# EAGLE design PICTQFP100_v2 (EAGLE 5.07)
PROJECT: Microchip TQFP-100 BB V1
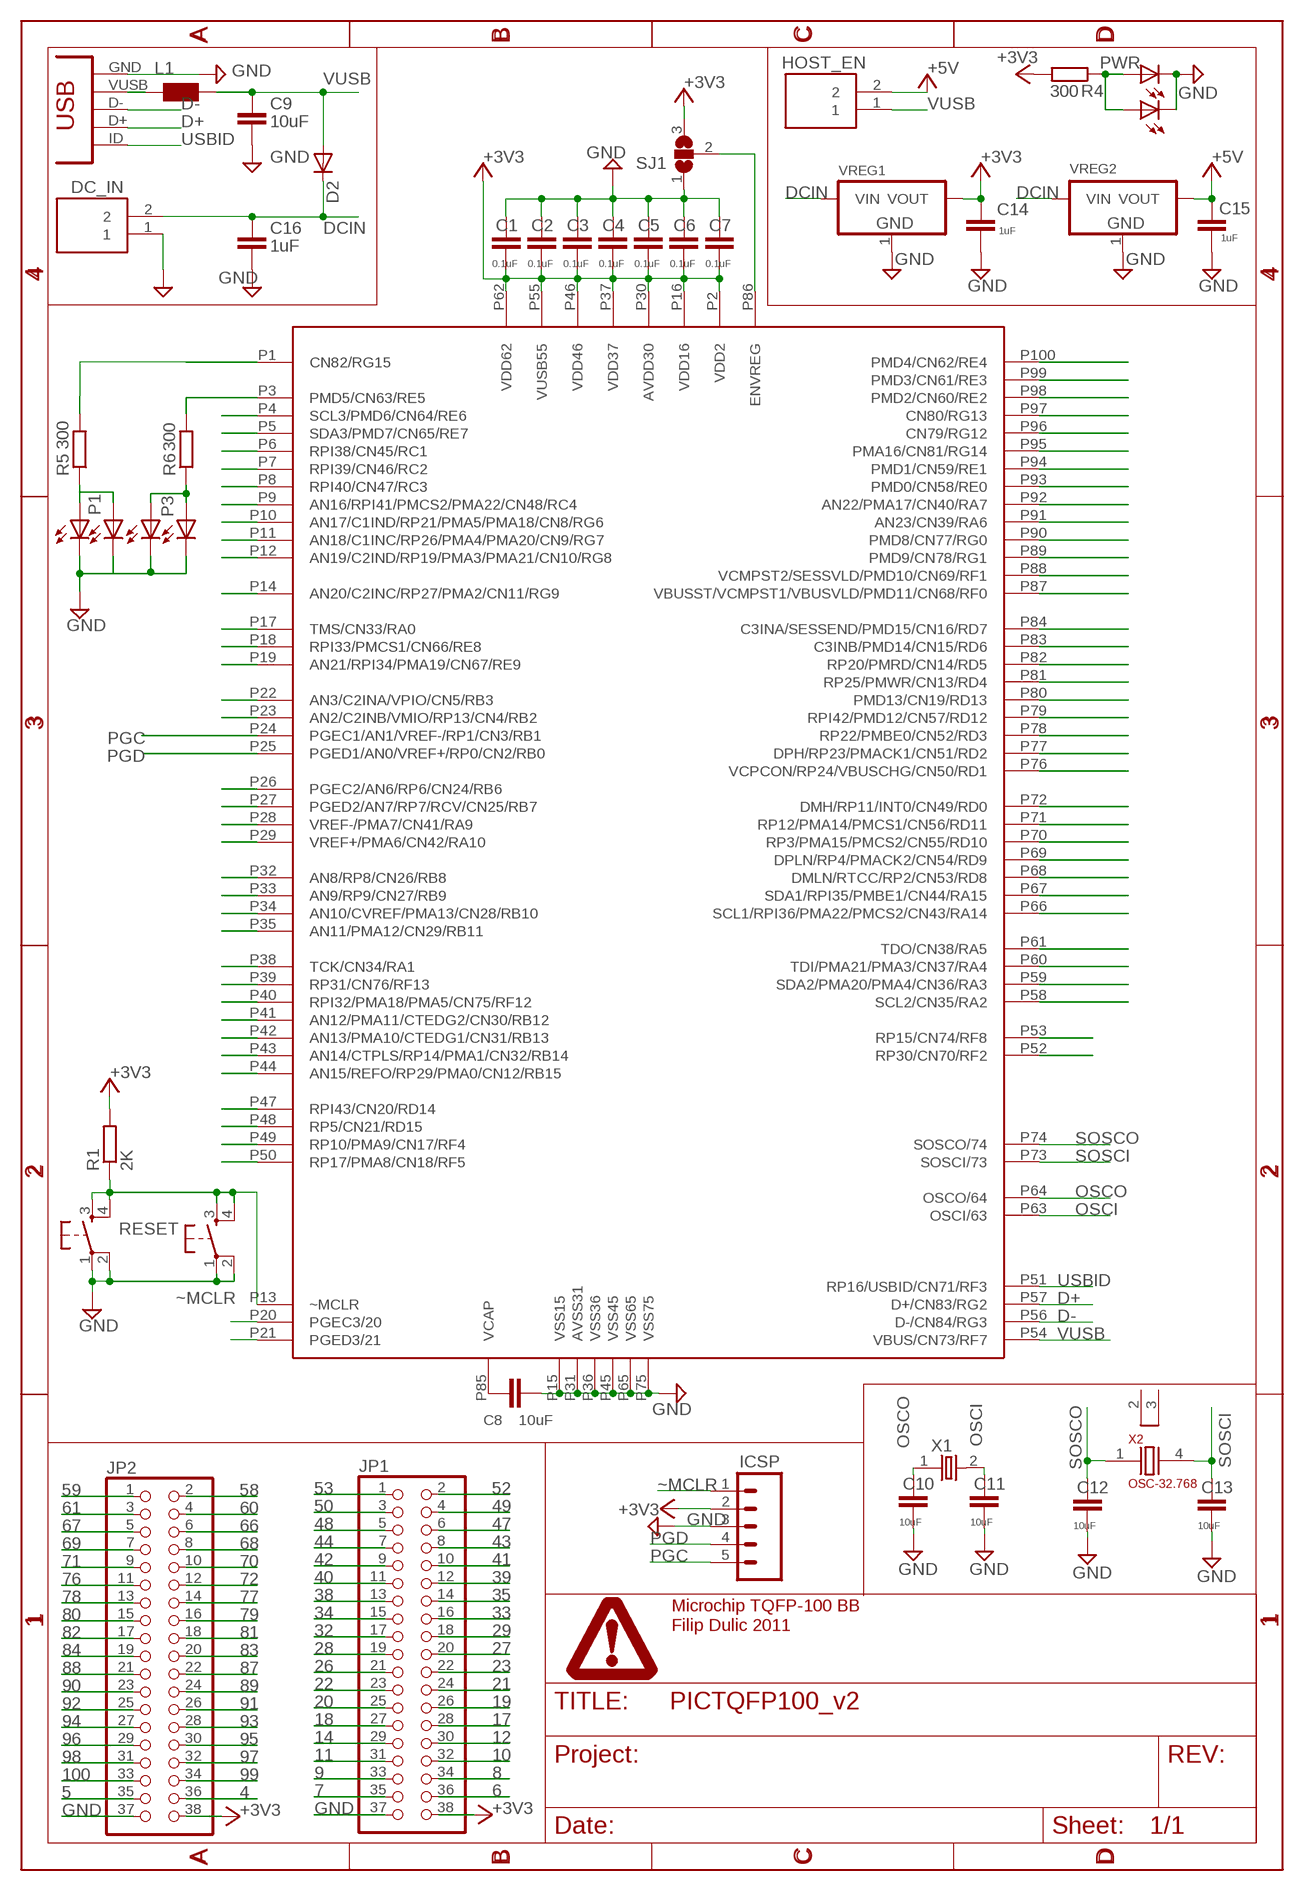
[diagram p0: schematic, sheet 1]

## Parts
C1  0.1uF  CAPC805  [C805]
C2  0.1uF  CAPC805  [C805]
C3  0.1uF  CAPC805  [C805]
C4  0.1uF  CAPC805  [C805]
C5  0.1uF  CAPC805  [C805]
C6  0.1uF  CAPC805  [C805]
C7  0.1uF  CAPC805  [C805]
C8  10uF  CAPC805  [C805]
C9  10uF  CAPC805  [C805]
C10  10uF  CAPC805  [C805]
C11  10uF  CAPC805  [C805]
C12  10uF  CAPC805  [C805]
C13  10uF  CAPC805  [C805]
C14  1uF  CAPC805  [C805]
C15  1uF  CAPC805  [C805]
C16  1uF  CAPC805  [C805]
D2  DIODE-SOD-123  [SOD-123]
DC_IN  HEADER1X2PTH  [M1X2]
HOST_EN  HEADER1X2PTH  [M1X2]
IC1  PIC24FJ256GB210  [DP_DEVICES_TQFP100-12MMX12MM]
ICSP  M05PTH  [1X05]
JP1  PINHD-2X19  [2X19]
JP2  PINHD-2X19  [2X19]
L1  WE-KIL_0805  [WE-KI_0805_B]
P1  P4  LEDCHIP-LED0805  [CHIP-LED0805]
P2  P4  LEDCHIP-LED0805  [CHIP-LED0805]
P3  P4  LEDCHIP-LED0805  [CHIP-LED0805]
P4  P4  LEDCHIP-LED0805  [CHIP-LED0805]
PWR  P4  LEDCHIP-LED0805  [CHIP-LED0805]
PWR1  P4  LEDCHIP-LED0805  [CHIP-LED0805]
R1  2K  RESISTORR805R805  [R805]
R4  300  RESISTORR805R805  [R805]
R5  300  RESISTORR805R805  [R805]
R6  300  RESISTORR805R805  [R805]
RESET  SW-SMD-SMALL  [TACT_SWITCH_SMALL]
RESET1  SW-SMD-SMALL  [TACT_SWITCH_SMALL]
SJ1  SJ2W  [SJ_2]
U$1  DINA4_L  [DP_LOGO]
USB  CON-USB-MINI-BUSB1  [CONN_USB_MINI-B]
VREG1  LD1117-3.3SOT223  [SOT223]
VREG2  LD1117-3.3SOT223  [SOT223]
X1  OSC-XTAL  [HC-49U]
X2  OSC-32.768  [CM309S]

## Nets
1: IC1.P1(CN82/RG15) R5.2
3: IC1.P3(PMD5/CN63/RE5) R6.2
4: IC1.P4(SCL3/PMD6/CN64/RE6) JP2.36
5: IC1.P5(SDA3/PMD7/CN65/RE7) JP2.35
6: IC1.P6(RPI38/CN45/RC1) JP1.36
7: IC1.P7(RPI39/CN46/RC2) JP1.35
8: IC1.P8(RPI40/CN47/RC3) JP1.34
9: IC1.P9(AN16/RPI41/PMCS2/PMA22/CN48/RC4) JP1.33
10: IC1.P10(AN17/C1IND/RP21/PMA5/PMA18/CN8/RG6) JP1.32
11: IC1.P11(AN18/C1INC/RP26/PMA4/PMA20/CN9/RG7) JP1.31
12: IC1.P12(AN19/C2IND/RP19/PMA3/PMA21/CN10/RG8) JP1.30
14: IC1.P14(AN20/C2INC/RP27/PMA2/CN11/RG9) JP1.29
17: IC1.P17(TMS/CN33/RA0) JP1.28
18: IC1.P18(RPI33/PMCS1/CN66/RE8) JP1.27
19: IC1.P19(AN21/RPI34/PMA19/CN67/RE9) JP1.26
20: IC1.P20(PGEC3/20) JP1.25
21: IC1.P21(PGED3/21) JP1.24
22: IC1.P22(AN3/C2INA/VPIO/CN5/RB3) JP1.23
23: IC1.P23(AN2/C2INB/VMIO/RP13/CN4/RB2) JP1.22
26: IC1.P26(PGEC2/AN6/RP6/CN24/RB6) JP1.21
27: IC1.P27(PGED2/AN7/RP7/RCV/CN25/RB7) JP1.20
28: IC1.P28(VREF-/PMA7/CN41/RA9) JP1.19
29: IC1.P29(VREF+/PMA6/CN42/RA10) JP1.18
32: IC1.P32(AN8/RP8/CN26/RB8) JP1.17
33: IC1.P33(AN9/RP9/CN27/RB9) JP1.16
34: IC1.P34(AN10/CVREF/PMA13/CN28/RB10) JP1.15
35: IC1.P35(AN11/PMA12/CN29/RB11) JP1.14
38: IC1.P38(TCK/CN34/RA1) JP1.13
39: IC1.P39(RP31/CN76/RF13) JP1.12
40: IC1.P40(RPI32/PMA18/PMA5/CN75/RF12) JP1.11
41: IC1.P41(AN12/PMA11/CTEDG2/CN30/RB12) JP1.10
42: IC1.P42(AN13/PMA10/CTEDG1/CN31/RB13) JP1.9
43: IC1.P43(AN14/CTPLS/RP14/PMA1/CN32/RB14) JP1.8
44: IC1.P44(AN15/REFO/RP29/PMA0/CN12/RB15) JP1.7
47: IC1.P47(RPI43/CN20/RD14) JP1.6
48: IC1.P48(RP5/CN21/RD15) JP1.5
49: IC1.P49(RP10/PMA9/CN17/RF4) JP1.4
50: IC1.P50(RP17/PMA8/CN18/RF5) JP1.3
52: IC1.P52(RP30/CN70/RF2) JP1.2
53: IC1.P53(RP15/CN74/RF8) JP1.1
58: IC1.P58(SCL2/CN35/RA2) JP2.2
59: IC1.P59(SDA2/PMA20/PMA4/CN36/RA3) JP2.1
60: IC1.P60(TDI/PMA21/PMA3/CN37/RA4) JP2.4
61: IC1.P61(TDO/CN38/RA5) JP2.3
66: IC1.P66(SCL1/RPI36/PMA22/PMCS2/CN43/RA14) JP2.6
67: IC1.P67(SDA1/RPI35/PMBE1/CN44/RA15) JP2.5
68: IC1.P68(DMLN/RTCC/RP2/CN53/RD8) JP2.8
69: IC1.P69(DPLN/RP4/PMACK2/CN54/RD9) JP2.7
70: IC1.P70(RP3/PMA15/PMCS2/CN55/RD10) JP2.10
71: IC1.P71(RP12/PMA14/PMCS1/CN56/RD11) JP2.9
72: IC1.P72(DMH/RP11/INT0/CN49/RD0) JP2.12
76: IC1.P76(VCPCON/RP24/VBUSCHG/CN50/RD1) JP2.11
77: IC1.P77(DPH/RP23/PMACK1/CN51/RD2) JP2.14
78: IC1.P78(RP22/PMBE0/CN52/RD3) JP2.13
79: IC1.P79(RPI42/PMD12/CN57/RD12) JP2.16
80: IC1.P80(PMD13/CN19/RD13) JP2.15
81: IC1.P81(RP25/PMWR/CN13/RD4) JP2.18
82: IC1.P82(RP20/PMRD/CN14/RD5) JP2.17
83: IC1.P83(C3INB/PMD14/CN15/RD6) JP2.20
84: IC1.P84(C3INA/SESSEND/PMD15/CN16/RD7) JP2.19
87: IC1.P87(VBUSST/VCMPST1/VBUSVLD/PMD11/CN68/RF0) JP2.22
88: IC1.P88(VCMPST2/SESSVLD/PMD10/CN69/RF1) JP2.21
89: IC1.P89(PMD9/CN78/RG1) JP2.24
90: IC1.P90(PMD8/CN77/RG0) JP2.23
91: IC1.P91(AN23/CN39/RA6) JP2.26
92: IC1.P92(AN22/PMA17/CN40/RA7) JP2.25
93: IC1.P93(PMD0/CN58/RE0) JP2.28
94: IC1.P94(PMD1/CN59/RE1) JP2.27
95: IC1.P95(PMA16/CN81/RG14) JP2.30
96: IC1.P96(CN79/RG12) JP2.29
97: IC1.P97(CN80/RG13) JP2.32
98: IC1.P98(PMD2/CN60/RE2) JP2.31
99: IC1.P99(PMD3/CN61/RE3) JP2.34
100: IC1.P100(PMD4/CN62/RE4) JP2.33
+3V3: C1.2 C2.2 C3.2 C4.2 C5.2 C6.2 C7.2 C14.1 IC1.P2(VDD2) IC1.P16(VDD16) IC1.P30(AVDD30) IC1.P37(VDD37) IC1.P46(VDD46) IC1.P55(VUSB55) IC1.P62(VDD62) ICSP.2 JP1.38 JP2.38 R1.2 R4.2 SJ1.3 VREG1.2(VOUT)
+5V: C15.1 HOST_EN.2 VREG2.2(VOUT)
D+: IC1.P57(D+/CN83/RG2) USB.D+
D-: IC1.P56(D-/CN84/RG3) USB.D-
DCIN: C16.1 D2.C DC_IN.2 VREG1.3(VIN) VREG2.3(VIN)
GND: C1.1 C2.1 C3.1 C4.1 C5.1 C6.1 C7.1 C8.2 C9.2 C10.2 C11.2 C12.2 C13.2 C14.2 C15.2 C16.2 DC_IN.1 IC1.P15(VSS15) IC1.P31(AVSS31) IC1.P36(VSS36) IC1.P45(VSS45) IC1.P65(VSS65) IC1.P75(VSS75) ICSP.3 JP1.37 JP2.37 P1.C P2.C P3.C P4.C PWR1.C PWR.C RESET1.1 RESET1.2 RESET.1 RESET.2 SJ1.1 USB.GND VREG1.1(GND) VREG2.1(GND)
N$1: C8.1 IC1.P85(VCAP)
N$3: IC1.P86(ENVREG) SJ1.2
N$6: PWR1.A PWR.A R4.1
N$7: P1.A P4.A R5.1
N$8: P2.A P3.A R6.1
OSCI: C11.1 IC1.P63(OSCI/63) X1.2
OSCO: C10.1 IC1.P64(OSCO/64) X1.1
PGC: IC1.P24(PGEC1/AN1/VREF-/RP1/CN3/RB1) ICSP.5
PGD: IC1.P25(PGED1/AN0/VREF+/RP0/CN2/RB0) ICSP.4
SOSCI: C13.1 IC1.P73(SOSCI/73) X2.4
SOSCO: C12.1 IC1.P74(SOSCO/74) X2.1
USBID: IC1.P51(RP16/USBID/CN71/RF3) USB.ID(USBID)
VUSB: C9.1 D2.A HOST_EN.1 IC1.P54(VBUS/CN73/RF7) L1.1
VUSBO: L1.2 USB.VUSB
~MCLR: IC1.P13(~MCLR) ICSP.1 R1.1 RESET1.3 RESET1.4 RESET.3 RESET.4
Unconnected: USB.BODY@1(BODY) USB.BODY@2(BODY) USB.BODY@3(BODY) USB.BODY@4(BODY) X2.2 X2.3

## Notes on the sheet
- Microchip TQFP-100 BB
- Filip Dulic 2011

## Library data of the parts
C1-C16 = dp_devices:CAP
D2 = dp_devices:DIODE: Various Diode Packages
DC_IN HOST_EN = dp_devices:HEADER1X2
IC1 = fica:PIC24FJ256GB210
ICSP = SparkFun:M05: Header 5 Standard 5-pin 0.1" header. Use with straight break away headers (SKU : PRT-00116), right angle break away headers (PRT-00553), swiss pins (PRT-00743), machine pins (PRT-00117), and female headers (PRT-00115). Molex polarized connector foot print use with SKU : PRT-08230 with associated crimp pins and housings.
JP1 JP2 = fica:PINHD-2X19: PIN HEADER
L1 = wuerth-elektronik:WE-KIL: SMD Wire Wound Ceramic Inductor WE-KIL - Low profile - High Q values -- Bluetooth -- Wireless LAN -- RF oscillation circuit -- IF impedance matching
P1-P4 PWR PWR1 = led:LED: LED OSRAM: - CHIPLED LG R971, LG N971, LY N971, LG Q971, LY Q971, LO R971, LY R971 LH N974, LH R974 LS Q976, LO Q976, LY Q976 LO Q996 - Hyper CHIPLED LW Q18S LB Q993, LB Q99A, LB R99A - SideLED LS A670, LO A670, LY A670, LG A670, LP A670 LB A673, LV A673, LT A673, LW A673 LH A674 LY A675 LS A676, LA A676, LO A676, LY A676, LW A676 LS A679, LY A679, LG A679 - Hyper Micro SIDELED® LS Y876, LA Y876, LO Y876, LY Y876 LT Y87S - SmartLED LW L88C, LW L88S LB L89C, LB L89S, LG L890 LS L89K, LO L89K, LY L89K LS L896, LA L896, LO L896, LY L896 - TOPLED LS T670, LO T670, LY T670, LG T670, LP T670 LSG T670, LSP T670, LSY T670, LOP T670, LYG T670 LG T671, LOG T671, LSG T671 LB T673, LV T673, LT T673, LW T673 LH T674 LS T676, LA T676, LO T676, LY T676, LB T676, LH T676, LSB T676, LW T676 LB T67C, LV T67C, LT T67C, LS T67K, LO T67K, LY T67K, LW E67C LS E67B, LA E67B, LO E67B, LY E67B, LB E67C, LV E67C, LT E67C LW T67C LS T679, LY T679, LG T679 LS T770, LO T770, LY T770, LG T770, LP T770 LB T773, LV T773, LT T773, LW T773 LH T774 LS E675, LA E675, LY E675, LS T675 LS T776, LA T776, LO T776, LY T776, LB T776 LHGB T686 LT T68C, LB T68C - Hyper Mini TOPLED® LB M676 - Mini TOPLED Santana® LG M470 LS M47K, LO M47K, LY M47K Source: http://www.osram.convergy.de LUXEON: - LUMILED® LXK2-PW12-R00, LXK2-PW12-S00, LXK2-PW14-U00, LXK2-PW14-V00 LXK2-PM12-R00, LXK2-PM12-S00, LXK2-PM14-U00 LXK2-PE12-Q00, LXK2-PE12-R00, LXK2-PE12-S00, LXK2-PE14-T00, LXK2-PE14-U00 LXK2-PB12-K00, LXK2-PB12-L00, LXK2-PB12-M00, LXK2-PB14-N00, LXK2-PB14-P00, LXK2-PB14-Q00 LXK2-PR12-L00, LXK2-PR12-M00, LXK2-PR14-Q00, LXK2-PR14-R00 LXK2-PD12-Q00, LXK2-PD12-R00, LXK2-PD12-S00 LXK2-PH12-R00, LXK2-PH12-S00 LXK2-PL12-P00, LXK2-PL12-Q00, LXK2-PL12-R00 Source: www.luxeon.com KINGBRIGHT: KA-3528ASYC Source: www.kingbright.com
R1 R4-R6 = dp_devices:RESISTOR
RESET RESET1 = dp_devices:SW-SMD-SMALL
SJ1 = jumper:SJ2W: SMD solder JUMPER
U$1 = dp_devices:DINA4_L: A4 DP frame Standard Dangerous Prototypes schematic frame. Automagically adds the DP logo and standard texts to the PCB Use the atrribute in the schematic editor to change the fields.; FF1: fulfillment by; FF2: Seeed Studio; FF3: www.seeedstudio.com; LICENSE: CC-BY-SA; PROJECT: Projectname; URL1: http://; URL2: DangerousPrototypes.com
USB = dp_devices:CON-USB-MINI-B: USB connector
VREG1 VREG2 = dp_devices:LD1117-3.3
X1 = dp_devices:OSC-XTAL
X2 = fica:OSC-32.768

## Board
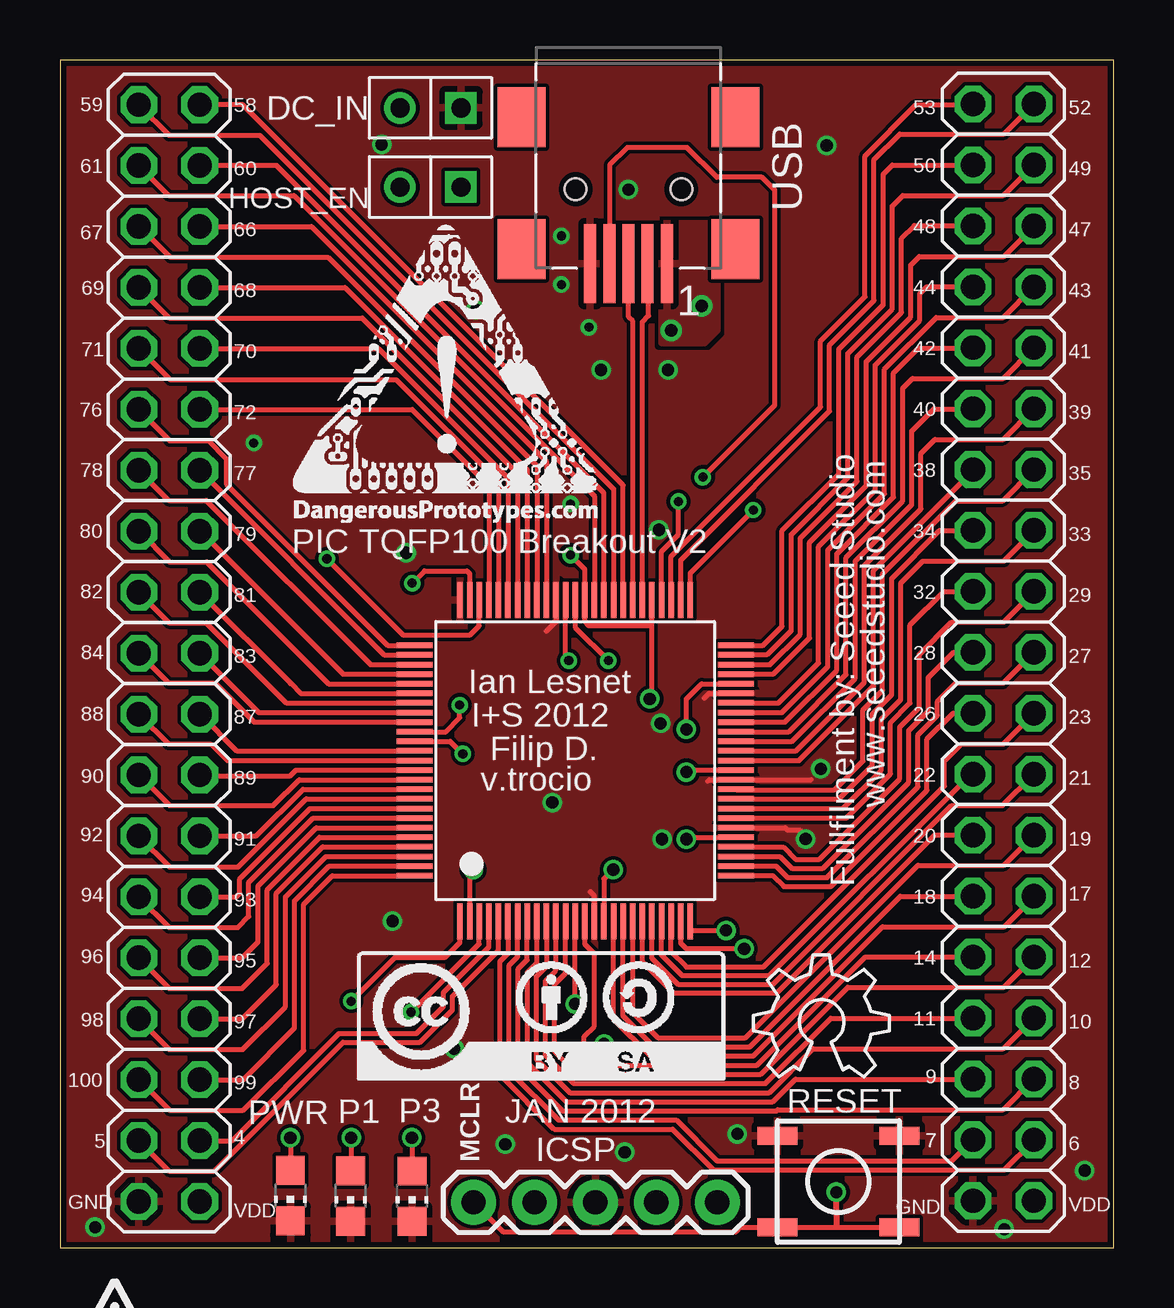
[diagram p1: board, top side]
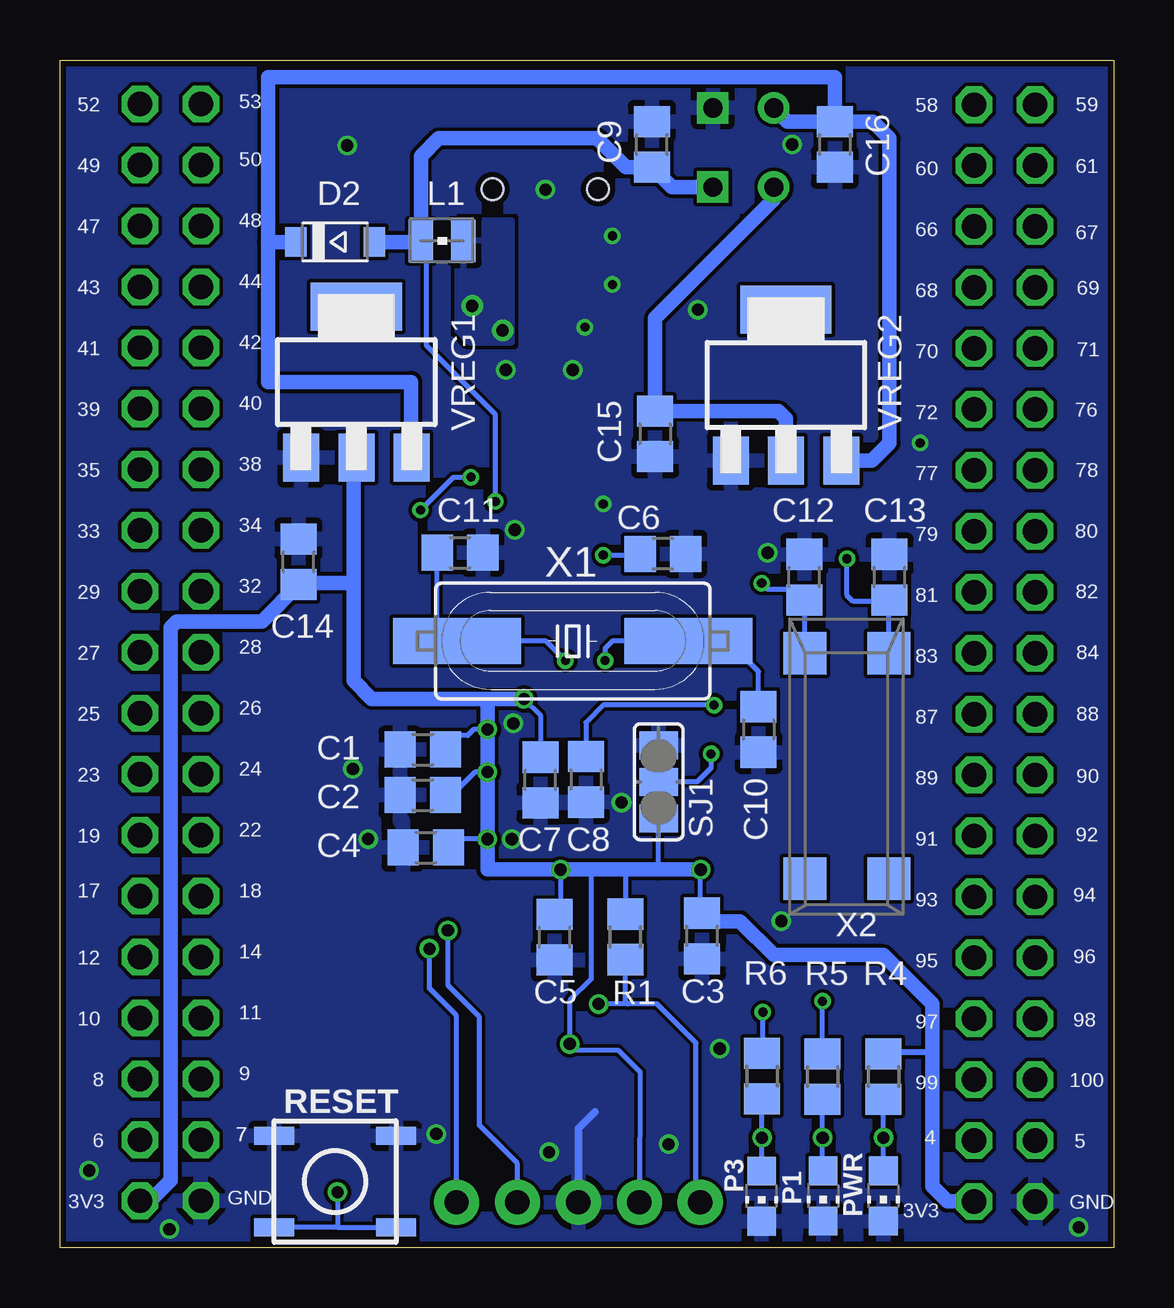
[diagram p2: board, bottom side, seen from below]

Size 43.93 x 49.52 mm. Coordinates in mm from the lower left corner, seen from the top.
Outline: 0,0 43.93,0 43.93,49.52 0,49.52 0,0
Copper layers (1*16): Top 0.035mm / dielectric 1.5mm / Bottom 0.035mm
Design rules "Fusion_eagle_rule_v1.1": minimum track width 6mil, minimum drill 12mil, track to track 6mil, track to pad 6mil, pad to pad 6mil, via to via 6mil, smd to smd 0mil, copper to edge 10mil, drill to drill 10mil, minimum pad ring 10mil, minimum via ring 6mil, stop-mask expansion 2mil, vias tented up to drill 100mil, thermal gap 10mil

### Footprints (pad centres in the part's own frame; a part is rotated, then mirrored left to right if it is on the bottom)
C805 = smd 1.3 x 1.5: 1 -0.95,0; 2 0.95,0
SOD-123 = smd 0.91 x 1.22: A 1.635,0; C -1.635,0
M1X2 = drill 0.8 square: 1 -1.27,0 | drill 0.8 round: 2 1.27,0
DP_DEVICES_TQFP100-12MMX12MM = smd 0.23 x 1.5: P1 -4.8,-6.7; P2 -4.4,-6.7; P3 -4,-6.7; P4 -3.6,-6.7; P5 -3.2,-6.7; P6 -2.8,-6.7; P7 -2.4,-6.7; P8 -2,-6.7; P9 -1.6,-6.7; P10 -1.2,-6.7; P11 -0.8,-6.7; P12 -0.4,-6.7; P13 0,-6.7; P14 0.4,-6.7; P15 0.8,-6.7; P16 1.2,-6.7; P17 1.6,-6.7; P18 2,-6.7; P19 2.4,-6.7; P20 2.8,-6.7; P21 3.2,-6.7; P22 3.6,-6.7; P23 4,-6.7; P24 4.4,-6.7; P25 4.8,-6.7; P51 4.8,6.7; P52 4.4,6.7; P53 4,6.7; P54 3.6,6.7; P55 3.2,6.7; P56 2.8,6.7; P57 2.4,6.7; P58 2,6.7; P59 1.6,6.7; P60 1.2,6.7; P61 0.8,6.7; P62 0.4,6.7; P63 0,6.7; P64 -0.4,6.7; P65 -0.8,6.7; P66 -1.2,6.7; P67 -1.6,6.7; P68 -2,6.7; P69 -2.4,6.7; P70 -2.8,6.7; P71 -3.2,6.7; P72 -3.6,6.7; P73 -4,6.7; P74 -4.4,6.7; P75 -4.8,6.7 | smd 1.5 x 0.23: P26 6.7,-4.8; P27 6.7,-4.4; P28 6.7,-4; P29 6.7,-3.6; P30 6.7,-3.2; P31 6.7,-2.8; P32 6.7,-2.4; P33 6.7,-2; P34 6.7,-1.6; P35 6.7,-1.2; P36 6.7,-0.8; P37 6.7,-0.4; P38 6.7,0; P39 6.7,0.4; P40 6.7,0.8; P41 6.7,1.2; P42 6.7,1.6; P43 6.7,2; P44 6.7,2.4; P45 6.7,2.8; P46 6.7,3.2; P47 6.7,3.6; P48 6.7,4; P49 6.7,4.4; P50 6.7,4.8; P76 -6.7,4.8; P77 -6.7,4.4; P78 -6.7,4; P79 -6.7,3.6; P80 -6.7,3.2; P81 -6.7,2.8; P82 -6.7,2.4; P83 -6.7,2; P84 -6.7,1.6; P85 -6.7,1.2; P86 -6.7,0.8; P87 -6.7,0.4; P88 -6.7,0; P89 -6.7,-0.4; P90 -6.7,-0.8; P91 -6.7,-1.2; P92 -6.7,-1.6; P93 -6.7,-2; P94 -6.7,-2.4; P95 -6.7,-2.8; P96 -6.7,-3.2; P97 -6.7,-3.6; P98 -6.7,-4; P99 -6.7,-4.4; P100 -6.7,-4.8
1X05 = drill 1.016 pad 1.88 round: 1 0,0; 2 2.54,0; 3 5.08,0; 4 7.62,0; 5 10.16,0
2X19 = drill 1.016 octagon: 1 -22.86,-1.27; 2 -22.86,1.27; 3 -20.32,-1.27; 4 -20.32,1.27; 5 -17.78,-1.27; 6 -17.78,1.27; 7 -15.24,-1.27; 8 -15.24,1.27; 9 -12.7,-1.27; 10 -12.7,1.27; 11 -10.16,-1.27; 12 -10.16,1.27; 13 -7.62,-1.27; 14 -7.62,1.27; 15 -5.08,-1.27; 16 -5.08,1.27; 17 -2.54,-1.27; 18 -2.54,1.27; 19 0,-1.27; 20 0,1.27; 21 2.54,-1.27; 22 2.54,1.27; 23 5.08,-1.27; 24 5.08,1.27; 25 7.62,-1.27; 26 7.62,1.27; 27 10.16,-1.27; 28 10.16,1.27; 29 12.7,-1.27; 30 12.7,1.27; 31 15.24,-1.27; 32 15.24,1.27; 33 17.78,-1.27; 34 17.78,1.27; 35 20.32,-1.27; 36 20.32,1.27; 37 22.86,-1.27; 38 22.86,1.27
WE-KI_0805_B = smd 1.02 x 1.78: 1 -0.89,0; 2 0.89,0
CHIP-LED0805 = smd 1.2 x 1.2: A 0,-1.05; C 0,1.05
R805 = smd 1.3 x 1.5: 1 -0.95,0; 2 0.95,0
TACT_SWITCH_SMALL = smd 1.651 x 0.762: 1 -2.54,1.905; 2 2.54,1.905; 3 -2.54,-1.905; 4 2.54,-1.905
SJ_2 = smd 1.168 x 1.6: 1 -1.524,0; 2 0,0; 3 1.524,0
CONN_USB_MINI-B = smd 2 x 2.5: BODY@1 -4.45,2.5; BODY@2 4.45,2.5; BODY@3 4.45,-3; BODY@4 -4.45,-3 | smd 0.5 x 3.3: D+ 0,3.1; D- -0.8,3.1; GND 1.6,3.1; ID 0.8,3.1; VUSB -1.6,3.1 | hole 0.9: -2.2,0; 2.2,0
SOT223 = smd 1.5 x 2: 1 -2.3,-3.15; 2 0,-3.15; 3 2.3,-3.15 | smd 3.8 x 2: 4 0,3.15
HC-49U = smd 5.334 x 1.93: 1 -4.826,0; 2 4.826,0
CM309S = smd 1.778 x 1.778: 1 -4.7,-1.75; 2 4.7,-1.75; 3 4.7,1.75; 4 -4.7,1.75

### Placement (x,y rotation side)
C1  28.8,20.78 0 bottom
C2  28.8,18.88 0 bottom
C3  17.16,13 90 bottom
C4  28.68,16.69 0 bottom
C5  23.31,12.95 90 bottom
C6  18.8,28.93 180 bottom
C7  23.9,19.51 90 bottom
C8  22,19.53 270 bottom
C9  19.25,46 90 bottom
C10  14.81,21.62 270 bottom
C11  27.25,28.98 0 bottom
C12  12.9,27.97 90 bottom
C13  9.35,27.97 90 bottom
C14  33.99,28.6 90 bottom
C15  19.13,33.93 270 bottom
C16  11.63,46 270 bottom
D2  32.46,41.94 0 bottom
DC_IN  15.44,47.52 180 top
HOST_EN  15.44,44.22 180 top
IC1  21.48,20.32 0 top
ICSP  17.24,1.91 0 top
JP1  39.33,24.83 270 top
JP2  4.55,24.8 270 top
L1  28,41.98 0 bottom
P1  12.12,2.17 180 top
P2  14.68,2.16 180 bottom
P3  14.67,2.16 180 top
P4  12.12,2.17 180 bottom
PWR  9.61,2.18 180 top
PWR1  9.6,2.17 180 bottom
R1  20.36,12.97 90 bottom
R4  9.6,7.14 90 bottom
R5  12.14,7.14 90 bottom
R6  14.67,7.16 90 bottom
RESET  32.45,2.77 0 top
RESET1  32.46,2.77 0 bottom
SJ1  18.97,19.43 270 bottom
U$1  2.29,-3.94 0 top  (outside the outline)
U$2  [DP_LOGO_ART_0.5X0.5]  9.73,30.25 0 top
U$3  [OSHW_6X200_NOTEXT]  28.91,7.14 0 top
U$4  [CC-BY-SA]  12.4,7.01 0 top
USB  23.7,44.13 180 top
VREG1  31.57,36.09 0 bottom
VREG2  13.67,35.97 0 bottom
X1  22.56,25.3 180 bottom
X2  11.13,20.09 270 bottom

### Tracks (layer width: path | path; a pad name or v marks a point on that pad's centre or on a via)
1  (via drill 0.38)
  Top 0.203: IC1.P1 16.68,12.74 16.05,12.12 13.97,12.12 v12.14,10.29
  Bottom 0.203: R5.2 v12.14,10.29
3  (via drill 0.38)
  Top 0.203: IC1.P3 17.48,12.68 v14.63,9.83
  Bottom 0.203: v14.63,9.83 14.63,8.15 R6.2
4
  Top 0.203: IC1.P4 17.88,12.54 15.99,10.66 15.99,10.07 14.86,8.94 11.63,8.94 7.17,4.48 JP2.36
5
  Top 0.203: IC1.P5 18.28,12.41 16.36,10.49 16.36,9.92 15.01,8.57 11.8,8.57 6.43,3.2 4.55,3.2 JP2.35
6
  Top 0.203: JP1.36 40.6,4.48 39.37,3.25 27.24,3.25 25.54,4.95 20.6,4.95 18.34,7.21 18.34,11.94 18.69,12.29 18.69,13.6 IC1.P6
7
  Top 0.203: IC1.P7 19.08,12.14 18.72,11.79 18.72,7.39 20.78,5.33 25.69,5.33 27.39,3.63 27.41,3.64 37.19,3.64 JP1.35
8
  Top 0.203: JP1.34 39.32,5.77 29.92,5.77 29.87,5.72 20.96,5.72 19.1,7.57 19.1,11.63 19.48,12.01 IC1.P8
9
  Top 0.203: IC1.P9 19.88,11.87 19.48,11.48 19.48,7.72 21.11,6.1 29.72,6.1 30.66,7.04 38.04,7.04 JP1.33
10
  Top 0.203: JP1.32 39.32,8.31 31.39,8.31 29.57,6.48 21.26,6.48 19.86,7.87 19.86,11.33 20.29,11.76 20.29,13.6 IC1.P10
11
  Top 0.203: IC1.P11 20.68,11.58 20.24,11.15 20.24,8.03 21.41,6.86 29.41,6.86 32.13,9.58 38.04,9.58 JP1.31
12
  Top 0.203: IC1.P12 21.08,11.45 20.63,11 20.63,8.18 21.56,7.24 29.21,7.24 32.84,10.87 39.34,10.87 JP1.30
14
  Top 0.203: JP1.29 33.57,12.13 29.06,7.62 22.2,7.62 21.84,7.98 21.84,8.81 22.28,9.25 22.28,12.27 21.9,12.65 21.9,13.6 IC1.P14
17
  Top 0.203: IC1.P17 23.08,9.54 24.61,8 28.91,8 34.29,13.39 39.37,13.39 40.6,14.61 JP1.28
18
  Top 0.203: IC1.P18 23.48,9.67 24.77,8.38 28.75,8.38 35.03,14.66 38.04,14.66 JP1.27
19
  Top 0.203: IC1.P19 23.88,9.8 24.92,8.76 28.58,8.76 35.76,15.95 39.34,15.95 JP1.26
20
  Top 0.203: IC1.P20 24.28,11.93 25.58,10.63 29.88,10.63 36.47,17.21 JP1.25
21
  Top 0.203: IC1.P21 24.68,12.08 25.75,11 29.72,11 37.16,18.44 39.29,18.44 JP1.24
22
  Top 0.203: IC1.P22 25.07,12.22 25.93,11.35 29.57,11.35 37.96,19.75 JP1.23
23
  Top 0.203: JP1.22 39.32,21.01 37.57,21.01 36.87,20.31 36.87,19.26 29.32,11.71 26.11,11.71 25.48,12.34 IC1.P23
26
  Top 0.203: IC1.P26 29.72,15.52 30.18,15.06 32.13,15.06 36.14,19.08 36.14,21.21 37.24,22.3 38.04,22.3 JP1.21
27
  Top 0.203: JP1.20 39.32,23.55 37.34,23.55 36.58,22.78 36.58,22.2 35.76,21.39 35.76,19.23 31.98,15.44 30.33,15.44 29.85,15.92 IC1.P27
28
  Top 0.203: IC1.P28 30.01,16.32 30.51,15.82 31.8,15.82 35.38,19.41 35.38,21.56 36.2,22.38 36.2,23.77 37.26,24.84 38.04,24.84 JP1.19
29
  Top 0.203: JP1.18 40.6,27.34 39.34,26.09 37.16,26.09 35.81,24.74 35.81,22.53 35,21.72 35,19.56 31.65,16.21 30.66,16.21 30.15,16.71 IC1.P29
32
  Top 0.203: IC1.P32 32.78,17.92 34.62,19.76 34.62,21.89 35.43,22.71 35.43,25.96 36.84,27.37 JP1.17
33
  Top 0.203: JP1.16 40.6,29.88 39.34,28.63 35.97,28.63 35.05,27.71 35.05,22.86 34.24,22.05 34.24,19.91 32.64,18.31 IC1.P33
34
  Top 0.203: JP1.15 36.67,29.91 34.67,27.91 34.67,23.06 33.86,22.25 33.86,20.12 32.46,18.72 IC1.P34
  Top 0.305: JP1.15 38.02,29.94
35
  Top 0.203: JP1.14 39.29,31.14 37.34,31.14 34.29,28.09 34.29,23.24 33.48,22.43 33.48,20.29 32.28,19.1 28.2,19.1 IC1.P35
38
  Top 0.203: IC1.P38 30.81,20.32 33.91,23.42 33.91,28.24 38.13,32.46 38.04,32.46 JP1.13
39
  Top 0.203: JP1.12 39.32,33.71 36.47,33.71 35.89,33.12 35.89,30.81 33.53,28.45 33.53,23.57 30.68,20.73 28.18,20.73 IC1.P39
40
  Top 0.203: IC1.P40 30.52,21.12 33.15,23.75 33.15,28.63 35.51,30.99 35.51,34.06 36.42,34.98 38.04,34.98 JP1.11
41
  Top 0.203: JP1.10 39.32,36.25 35.53,36.25 35.13,35.84 35.13,31.14 32.77,28.78 32.77,23.9 30.38,21.51 IC1.P41
42
  Top 0.203: IC1.P42 30.23,21.92 32.39,24.08 32.39,28.93 34.75,31.29 34.75,36.47 35.79,37.52 38.04,37.52 JP1.9
43
  Top 0.203: IC1.P43 30.09,22.32 32,24.23 32,29.08 34.37,31.45 34.37,36.63 36.53,38.79 39.32,38.79 JP1.8
44
  Top 0.203: JP1.7 36.13,40.07 35.84,39.78 35.84,38.66 33.99,36.8 33.99,31.6 31.62,29.24 31.62,24.38 29.95,22.71 IC1.P44
47
  Top 0.203: JP1.6 40.6,42.58 39.34,41.33 35.81,41.33 35.46,40.97 35.46,38.81 33.6,36.96 33.6,31.78 31.24,29.41 31.24,25.43 29.74,23.93 IC1.P47
48
  Top 0.203: IC1.P48 29.6,24.32 30.86,25.58 30.86,29.59 33.22,31.95 33.22,37.13 35.08,38.99 35.08,42.09 35.61,42.62 38.04,42.62 JP1.5
49
  Top 0.203: JP1.4 39.32,43.87 35.13,43.87 34.7,43.43 34.7,39.14 32.84,37.29 32.84,32.11 30.48,29.74 30.48,25.73 29.49,24.74 28.2,24.74 IC1.P49
50
  Top 0.203: IC1.P50 29.31,25.12 30.1,25.91 30.1,29.9 32.46,32.26 32.46,37.47 34.32,39.32 34.32,44.75 34.7,45.14 38.04,45.14 JP1.3
52
  Top 0.203: JP1.2 39.34,46.43 35,46.43 33.93,45.36 33.93,39.5 32.08,37.64 32.08,34.87 25.88,28.68 25.88,27.03 IC1.P52
53
  Top 0.203: IC1.P53 25.48,28.83 31.7,35.05 31.7,37.8 33.55,39.65 33.55,45.52 35.69,47.65 38.02,47.65 JP1.1
58
  Top 0.203: JP2.2 7.61,47.66 23.48,31.79 IC1.P58
59
  Top 0.203: JP2.1 3.28,47.64 4.55,46.38 8.33,46.38 23.08,31.64 IC1.P59
60
  Top 0.203: JP2.4 9.04,45.12 22.68,31.48 IC1.P60
61
  Top 0.203: JP2.3 4.52,43.87 9.75,43.87 22.28,31.34 IC1.P61
66
  Top 0.203: JP2.6 10.48,42.58 20.28,32.79 IC1.P66
67
  Top 0.203: IC1.P67 19.88,32.6 11.18,41.3 4.6,41.3 3.32,42.58 JP2.5
68
  Top 0.203: JP2.8 11.88,40.04 19.48,32.44 IC1.P68
69
  Top 0.203: JP2.7 4.55,38.76 12.6,38.76 19.08,32.28 IC1.P69
70
  Top 0.203: IC1.P70 18.68,32.1 13.28,37.5 JP2.10
71
  Top 0.203: JP2.9 3.3,37.5 4.6,36.2 14.02,36.2 18.28,31.94 IC1.P71
72
  Top 0.203: IC1.P72 17.88,31.76 14.68,34.95 JP2.12
76
  Top 0.203: JP2.11 3.28,34.94 4.57,33.66 6.17,33.66 6.93,32.89 6.93,31.85 13.67,25.12 IC1.P76
77
  Top 0.203: IC1.P77 13.52,24.72 JP2.14
78
  Top 0.203: JP2.13 3.28,32.4 4.52,31.17 6.1,31.17 12.94,24.32 IC1.P78
79
  Top 0.203: JP2.16 5.84,29.88 11.79,23.92 IC1.P79
80
  Top 0.203: JP2.15 3.3,29.88 4.57,28.6 6.12,28.6 11.2,23.52 IC1.P80
81
  Top 0.203: JP2.18 5.82,27.32 9.63,23.52 | 9.63,23.52 9.6,23.52 | IC1.P81 10.03,23.12 9.63,23.52
82
  Top 0.203: JP2.17 3.28,27.32 4.55,26.06 6.1,26.06 9.44,22.72 IC1.P82
83
  Top 0.203: JP2.20 8.29,22.32 IC1.P83
84
  Top 0.203: IC1.P84 8.1,21.92 6.48,23.55 4.53,23.55 JP2.19
87
  Top 0.203: JP2.22 5.84,22.26 7.37,20.72 IC1.P87
88
  Top 0.203: JP2.21 4.52,21.01 6.3,21.01 6.99,20.32 IC1.P88
89
  Top 0.203: IC1.P89 9.84,19.92 9.6,19.69 5.86,19.69 JP2.24
90
  Top 0.203: JP2.23 3.3,19.72 4.57,18.44 8.89,18.44 9.97,19.52 IC1.P90
91
  Top 0.203: IC1.P91 10.13,19.12 8.19,17.18 JP2.26
92
  Top 0.203: JP2.25 3.28,17.16 4.57,15.88 7.42,15.88 10.26,18.72 IC1.P92
93
  Top 0.203: JP2.28 7.35,14.64 7.49,14.78 7.49,15.39 10.42,18.32 IC1.P93
94
  Top 0.203: JP2.27 4.55,13.36 7.42,13.36 7.87,13.82 7.87,15.24 10.55,17.92 IC1.P94
95
  Top 0.203: IC1.P95 10.69,17.52 8.26,15.09 8.26,12.75 7.59,12.09 JP2.30
96
  Top 0.203: IC1.P96 10.82,17.12 8.64,14.94 8.64,11.86 7.59,10.82 4.55,10.82 3.28,12.08 JP2.29
97
  Top 0.203: IC1.P97 10.95,16.72 9.02,14.78 9.02,10.97 7.6,9.56 JP2.32
98
  Top 0.203: IC1.P98 11.09,16.32 9.4,14.63 9.4,10.06 7.62,8.28 4.55,8.28 JP2.31
99
  Top 0.203: IC1.P99 11.22,15.92 9.78,14.48 9.78,9.17 7.63,7.02 JP2.34
100
  Top 0.203: JP2.33 3.3,7.02 4.57,5.74 7.65,5.74 10.16,8.23 10.16,14.33 11.35,15.52 IC1.P100
+3V3  (via drill 0.38, 0.51)
  Top 0.203: v21.29,28.88 21.88,28.29 IC1.P62 21.88,26.1 22.05,25.93 24.68,25.93 | v22.68,8.51 v22.68,8.52 | IC1.P46 26.75,23.52 26.11,22.89 v26.11,21.62 | IC1.P37 26.19,19.92 v26.11,19.84 | 24.68,25.93 24.68,22.97 v24.59,22.89 | 24.68,25.93 IC1.P55 | IC1.P16 22.68,15.39 v23.06,15.77 | IC1.P2 17.08,15.63 v17.22,15.77 | IC1.P30 26.19,17.12 v26.11,17.04
  Bottom 0.203: 21.29,28.96 v21.29,28.88 19.8,28.88 C6.2 | ICSP.2 19.75,7.33 20.67,8.26 22.43,8.26 v22.68,8.51 22.68,10.31 21.79,11.2 21.79,15.52 22.05,15.77 | C7.2 23.9,22.23 v24.59,22.89 | R1.2 20.36,15.61 20.52,15.77 | C5.2 23.15,13.9 23.06,14 v23.06,15.77 | C3.2 17.16,13.71 IC1.P2 17.08,14.1 17.22,14.25 v17.22,15.77 | SJ1.3 18.97,15.8 19,15.77 | C1.2 27.85,21.14 27.64,21.36 26.94,21.36 26.68,21.62 v26.11,21.62 | C2.2 27.58,18.88 26.62,19.84 v26.11,19.84 | C4.2 27.73,16.95 27.64,17.04 v26.11,17.04
  Bottom 0.254: v26.11,21.62 26.18,21.55 | R4.2 9.41,8.09 9.35,8.15 7.57,8.15
  Bottom 0.61: VREG1.2 31.6,32.94 31.7,33.05 31.7,27.71 | 31.7,27.71 33.99,27.71 C14.1 35.51,26.12 39.07,26.12 39.32,25.87 39.32,2.82 40.17,1.97 JP1.38 | 31.7,27.71 31.7,23.65 30.94,22.89 26.11,22.89 | 26.11,22.89 v26.11,21.62 v26.11,19.84 v26.11,17.04 | 26.11,22.89 v24.59,22.89 | v26.11,17.04 26.11,16.79 | v26.11,17.04 26.11,15.77 v23.06,15.77 22.05,15.77 20.52,15.77 19,15.77 v17.22,15.77 | IC1.P2 15.58,13.62 14.17,12.22 9.6,12.22 7.57,10.19 7.57,8.15 7.57,2.57 6.94,1.94 JP2.38
+5V
  Bottom 0.61: VREG2.2 13.67,34.57 13.98,34.88 C15.1 19.13,38.76 14.17,43.71 HOST_EN.2
D+
  Top 0.203: IC1.P57 23.88,38.63 23.7,38.81 USB.D+
D-
  Top 0.203: IC1.P56 24.28,38.6 24.54,38.86 24.54,41.02
  Top 0.254: 24.54,41.02 USB.D-
DCIN
  Bottom 0.61: C16.1 13.6,46.95 DC_IN.2 | C16.1 11.63,48.79 35.26,48.79 35.26,41.94 | 33.99,42.05 D2.C 35.26,41.94 | 35.26,41.94 35.26,36.09 29.29,36.09 29.29,32.96 VREG1.3 | VREG2.3 10.08,32.82 9.35,33.55 9.35,46.25 10.04,46.95 C16.1
GND  (via drill 0.38, 0.51)
  Top 0.203: IC1.P31 30.23,17.52 30.33,17.42 30.84,17.42 31.16,17.1 | 31.32,19.52 IC1.P36 27.06,19.52 27,19.46 | IC1.P45 27.06,23.12 26.85,22.91 | IC1.P15 22.28,14.68 22.1,14.86 | IC1.P65 20.68,26.11 20.27,25.7 | 37.8,1.71 JP1.37
  Bottom 0.305: 21.62,5.68 22.32,4.98 ICSP.3
  other vias: 23.7,44.12 31.96,45.95 14.43,28.98 13.41,46 20.52,18.57 31.72,19.97 31.08,17.05 1.47,0.87 18.56,4.32 16.43,8.31 13.86,13.62 22.56,36.6 24.97,29.93 25.35,36.6 17.34,39.11 39.36,0.78 23.54,3.99 42.72,3.23 28.24,4.76 21.29,31.01 8.08,33.55 20.9,42.19 22.05,38.38 20.9,40.16 25.03,21.87 25.1,17.04
  pour Top (rank 6): -0.13,49.53 43.94,49.53 43.94,0 -0.13,0
  pour Bottom (isolate 0.152, rank 6): 43.94,49.53 43.94,0 -0.13,0 -0.13,49.53
N$1  (via drill 0.38)
  Top 0.203: IC1.P85 16.08,21.52 16.66,22.1 v16.66,22.63
  Bottom 0.203: C8.1 22,21.91 21.29,22.63 v16.66,22.63
N$3  (via drill 0.38)
  Top 0.203: IC1.P86 16.27,21.12 v16.79,20.6
  Bottom 0.203: SJ1.2 17.37,19.43 16.79,20.02 v16.79,20.6
N$6  (via drill 0.51)
  Top 0.203: PWR.A v9.61,4.59 v9.6,4.6
  Bottom 0.203: PWR1.A v9.6,4.6 | v9.6,4.6 R4.1 | v9.6,4.6
N$7  (via drill 0.51)
  Top 0.203: v12.14,4.6 12.14,3.31
  Top 0.305: 12.14,3.31 P1.A
  Bottom 0.203: P4.A 12.14,3.25 v12.14,4.6 R5.1
N$8  (via drill 0.51)
  Top 0.203: P2.A v14.68,4.59 v14.67,4.6
  Bottom 0.203: v14.67,4.6 14.67,3.22 P2.A | v14.67,4.6 R6.1 | v14.67,4.6
OSCI  (via drill 0.38)
  Top 0.203: IC1.P63 21.48,25.87 v22.86,24.49
  Bottom 0.203: v22.86,24.49 23.67,25.3 X1.2 27.51,25.43 28.14,25.43 28.2,25.49 C11.1
OSCO  (via drill 0.38)
  Top 0.203: IC1.P64 21.08,24.62 v21.21,24.49
  Bottom 0.203: 15.65,25.07 17.82,25.07 17.73,25.16 X1.1 | X1.1 16.08,25.3 14.81,24.03 C10.1 | X1.1 20.9,25.3 21.21,24.99 v21.21,24.49
PGC  (via drill 0.51)
  Top 0.203: IC1.P24 25.88,12.71 26.11,12.47 v28.52,12.47
  Bottom 0.203: v28.52,12.47 28.52,10.82 27.4,9.7 ICSP.5
PGD  (via drill 0.51)
  Top 0.203: IC1.P25 26.28,13.25 26.3,13.23 v27.76,13.23
  Bottom 0.203: ICSP.4 24.86,3.02 24.86,3.52 26.45,5.11 26.45,9.63 27.76,10.95 v27.76,13.23
SOSCI  (via drill 0.38)
  Top 0.203: IC1.P73 17.48,25.93 17.09,25.55 14.3,25.55 v11.13,28.73
  Bottom 0.203: v11.13,28.73 11.13,27.2 10.87,26.95 9.41,26.95 C13.1 9.38,26.99 X2.4
SOSCO  (via drill 0.38)
  Top 0.203: IC1.P74 17.08,28.11 16.97,28.22 15.19,28.22 v14.68,27.71
  Bottom 0.203: X2.1 12.88,26.99 C12.1 13.35,27.46 14.43,27.46 v14.68,27.71
USBID  (via drill 0.38 pad 0.69)
  Top 0.203: USB.ID 23.04,41.17 23.04,41.71 22.91,41.83 22.91,45.14 23.65,45.87 26.14,45.87 27.38,44.63 29.26,44.63 29.79,44.09 29.79,35.13 v26.8,32.13 | IC1.P51 26.28,28.13 v28.91,30.76
  Bottom 0.203: v26.8,32.13 27.53,32.13 v28.91,30.76
VUSB  (via drill 0.38)
  Top 0.203: IC1.P54 25.08,29.04 25.78,29.74 v25.78,31.12
  Bottom 0.203: v25.78,31.12 25.78,34.75 28.65,37.62 28.65,41.94 28.7,41.98 L1.1
  Bottom 0.61: HOST_EN.1 18.43,44.22 C9.1 20.34,45.05 21.54,46.25 28.14,46.25 28.89,45.51 L1.1 29.12,41.98 29.16,41.94 D2.A
VUSBO  (via drill 0.51 pad 0.89)
  other vias: 26.75,39.27 25.48,38.25
  pour Bottom: 25.1,42.82 27.38,42.82 27.38,38.25 26.87,37.74 25.1,37.74
  pour Top: 25.1,38.76 25.1,37.74 26.87,37.74 27.38,38.25 27.38,42.7 25.1,42.7
~MCLR  (via drill 0.51)
  Top 0.203: 32.36,0.86 RESET.4 | ICSP.1 18.46,0.69 28.19,0.69 28.37,0.86 RESET.3 32.36,0.86 | 32.36,0.86 32.39,0.89 | v21.48,10.17 IC1.P13
  Top 0.254: v32.36,2.32 32.39,0.91 32.4,0.9 32.39,0.89
  Bottom 0.203: 17.21,1.46 ICSP.1 17.41,2.08 17.41,8.55 19.04,10.17 20.26,10.17 | 32.35,0.86 RESET1.4 | 32.35,2.24 32.35,0.86 | 32.35,0.86 RESET1.3 | 20.26,10.17 v21.48,10.17 | R1.1 20.36,10.27 20.26,10.17
  Bottom 0.254: v32.36,2.32 32.35,2.24

### Text on the board
tNames: 59 | 58 | 53 | 52 | 61 | 60 | 50 | 49 | 67 | 66 | 48 | 47 | 69 | 68 | 44 | 43 | 71 | 70 | 42 | 41 | 76 | 72 | 40 | 39 | 78 | 77 | 38 | 35 | 80 | 34 | 79 | PIC TQFP100 Breakout V2 | 33 | 82 | 81 | 32 | 29 | 84 | 83 | 28 | 27 | Ian Lesnet | 88 | 87 | I+S 2012 | 26 | 23 | Filip D. | 90 | 89 | v.trocio | 22 | 21 | www.seeedstudio.com | 92 | 91 | 20 | 19 | Fullfilment by: Seeed Studio | 94 | 93 | 18 | 17 | 96 | 95 | 14 | 12 | 98 | 97 | 11 | 10 | 100 | 99 | 9 | 8 | JAN 2012 | 5 | 4 | MCLR | 7 | 7 | 6 | GND | GND | VDD | VDD
bNames: 59 | 58 | 53 | 52 | 61 | 60 | 50 | 49 | 48 | 67 | 66 | 47 | 69 | 68 | 44 | 43 | 71 | 70 | 42 | 41 | 76 | 72 | 40 | 39 | 78 | 77 | 38 | 35 | 80 | 34 | 33 | 79 | 82 | 81 | 32 | 29 | 84 | 28 | 83 | 27 | 88 | 87 | 26 | 25 | 24 | 90 | 89 | 23 | 92 | 91 | 22 | 19 | 18 | 17 | 94 | 93 | 96 | 95 | 14 | 12 | 98 | 97 | 11 | 10 | 100 | 99 | 9 | 8 | RESET | 5 | 4 | 7 | 7 | 6 | GND | P1 | P3 | GND | 3V3 | 3V3 | PWR